# Altium schematic sheet LTC6820_chip.SchDoc
size A3; DocumentNumber: 6; SheetNumber: 6; SheetTotal: 6; SheetDescription: LTC6820
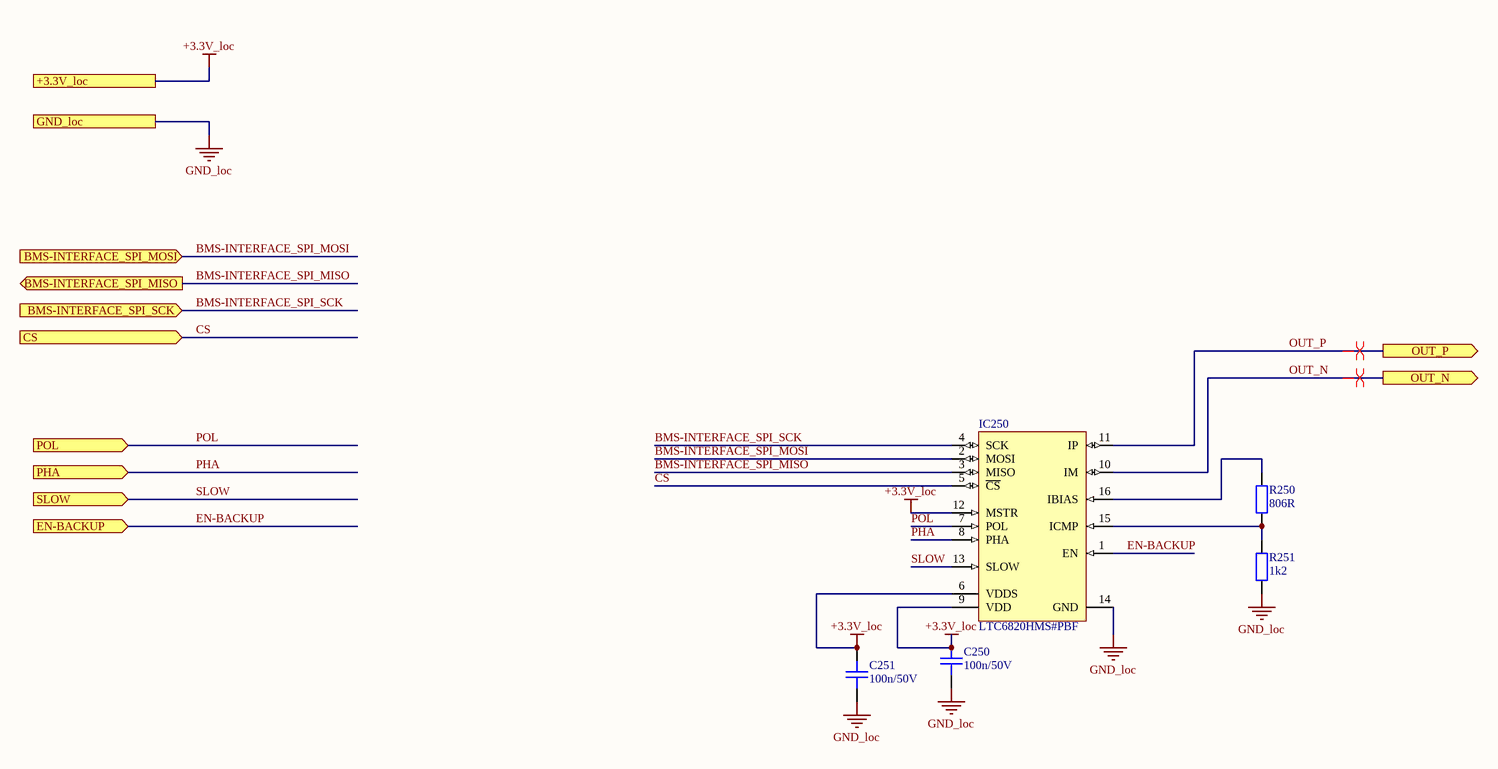
[diagram p0: LTC6820_chip.SchDoc]

## Parts
C250  100n/50V  [CAPC1608X08N]
C251  100n/50V  [CAPC1608X08N]
IC250  LTC6820HMS#PBF  [LT-MS-16_M]
R250  806R  [RESC1608X05N]
R251  1k2  [RESC1608X05N]

## Ports
+3.3V_loc, BMS-INTERFACE_SPI_MISO (out), BMS-INTERFACE_SPI_MOSI (in), BMS-INTERFACE_SPI_SCK (in), CS (in), EN-BACKUP (in), GND_loc, OUT_N (out), OUT_P (out), PHA (in), POL (in), SLOW (in)

## Nets
+3.3V_loc: C250.2 C251.2 IC250.6(VDDS) IC250.9(VDD) IC250.12(MSTR) ; port +3.3V_loc
GND_loc: C250.1 C251.1 IC250.14(GND) R251.1 ; port GND_loc
BMS-INTERFACE_SPI_MISO: IC250.3(MISO) ; port BMS-INTERFACE_SPI_MISO
BMS-INTERFACE_SPI_MOSI: IC250.2(MOSI) ; port BMS-INTERFACE_SPI_MOSI
BMS-INTERFACE_SPI_SCK: IC250.4(SCK) ; port BMS-INTERFACE_SPI_SCK
CS: IC250.5(~{CS}) ; port CS
EN-BACKUP: IC250.1(EN) ; port EN-BACKUP
OUT_N: IC250.10(IM) ; port OUT_N
OUT_P: IC250.11(IP) ; port OUT_P
PHA: IC250.8(PHA) ; port PHA
POL: IC250.7(POL) ; port POL
SLOW: IC250.13(SLOW) ; port SLOW
NetIC250_15: IC250.15(ICMP) R250.1 R251.2
NetIC250_16: IC250.16(IBIAS) R250.2

## Layout directives
differential pair: OUT_N, OUT_P

## Notes on the sheet
- Fraunhofer IISB
- Schottkystr. 10
- developed by:
- 91058 Erlangen
- Germany
- Author
- Project
- License
- Description
- File
- Version
- Release Date
- Sheet
- www.foxbms.org
- www.iisb.fraunhofer.de
- foxBMS Team
- /

## Library data of the parts
C250 C251 = gen_C_ceramic_100n_50V_X7R_0603: MLCC; Capacitance: 100n; Rated Voltage: 50V; Dielectric: X7R; Case EIA: 0603; Case Metric: 1608; PnP Package: C_0603_10; PnP Value: 100n/50V/X7R; PnP equipped: x; Automotive Qualified: True; Part Number: gen_C_ceramic_100n_50V_X7R_0603; Supplier 1: Farnell; Supplier Part Number 1: 2525267; Supplier 2: Digikey; Supplier Part Number 2: 490-6049-1-ND; Supplier 3: Farnell; Supplier Part Number 3: 2070398
IC250 = CMP-0937-00009-1: IsoSPI Isolated Communication Interface, 2.7 to 5.5 V, -40 to 125 degC, 16-Pin MSOP (MS), Pb-Free; Manufacturer: Linear Technology; IO Supply Current: 1 uA Max.; IO Supply Voltage Range: 1.7 to 5.5 V; Receiver Input Resistance: 35 kOhm; VBIAS: 1.9 to 2.1 V; Supply Current, IDLE State: 2 uA; ComponentLink3Description: Package Specification; Mounting Technology: Surface Mount; ComponentLink2URL: http://cds.linear.com/docs/en/datasheet/6820fa.pdf; PackageVersion: Rev. A; PackageReference: MS-16; PackageDescription: 16-Pin Micro Small Outline Package, Body 4.039 x 3 mm, Pitch 0.5 mm; ComponentLink3URL: http://cds.linear.com/docs/en/packaging/05081669_A_MS16.pdf; DatasheetVersion: Rev. A; Power Supply: 2.7 to 5.5 V; ComponentLink1Description: Manufacturer URL; PartNumber: LTC6820HMS#PBF; Temperature Range (degC): -40 to 125; ComponentLink1URL: http://www.linear.com/; ComponentLink2Description: Datasheet
R250 = gen_R_806R_0603: SMD Resistor 806R 0603; Tolerance: 1%; Power: 0.1W; Case EIA: 0603; Case Metric: 1608; Maximum Working Voltage: 75V; PnP Package: R_0603; Automotive Qualified: True; Part Number: gen_R_806R_0603; Operating Temperature: -55°C - +155°C; Resistance: 806R; Series: E96; PnP Value: 806R; Supplier 1: Farnell; Supplier Part Number 1: 2059324
R251 = gen_R_1k2_0603: SMD Resistor 1k2 0603; Tolerance: 1%; Power: 0.1W; Case EIA: 0603; Case Metric: 1608; Maximum Working Voltage: 75V; PnP Package: R_0603; Automotive Qualified: True; Part Number: gen_R_1k2_0603; Operating Temperature: -55°C - +155°C; Resistance: 1k2; Series: E24; PnP Value: 1k2; Supplier 1: Farnell; Supplier Part Number 1: 2073370